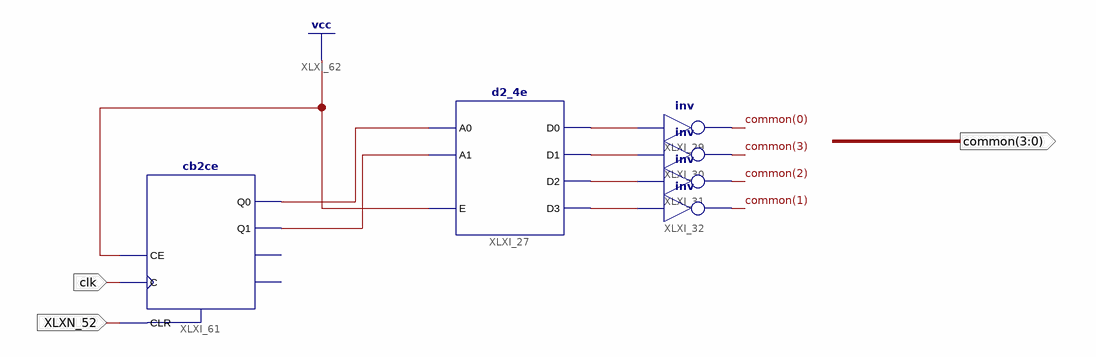
[diagram p0: schematic sheet 1]
// Xilinx ISE schematic newmultiplex.sch (spartan6) as structural Verilog: 6 symbols, 3 ports
module newmultiplex (
  input  clk,
  input  XLXN_52,
  output [3:0] common
);

  wire XLXN_43, XLXN_44, XLXN_45, XLXN_46, XLXN_47, XLXN_48;

  not XLXI_29 (common[0], XLXN_43);
  not XLXI_30 (common[3], XLXN_44);
  not XLXI_31 (common[2], XLXN_45);
  not XLXI_32 (common[1], XLXN_46);
  d2_4e XLXI_27 (.A0(XLXN_47), .A1(XLXN_48), .E(1'b1), .D0(XLXN_43), .D1(XLXN_44), .D2(XLXN_45), .D3(XLXN_46));
  cb2ce XLXI_61 (.C(clk), .CE(1'b1), .CLR(XLXN_52), .Q0(XLXN_47), .Q1(XLXN_48));  // open: CEO, TC
endmodule
